# Altium schematic sheet cpu1_gsm_comm.SchDoc
size A3; DocumentNumber: 4; Revision: V1.0; SheetNumber: 4; SheetTotal: 9; Rule: PcbType=ProtelPcb
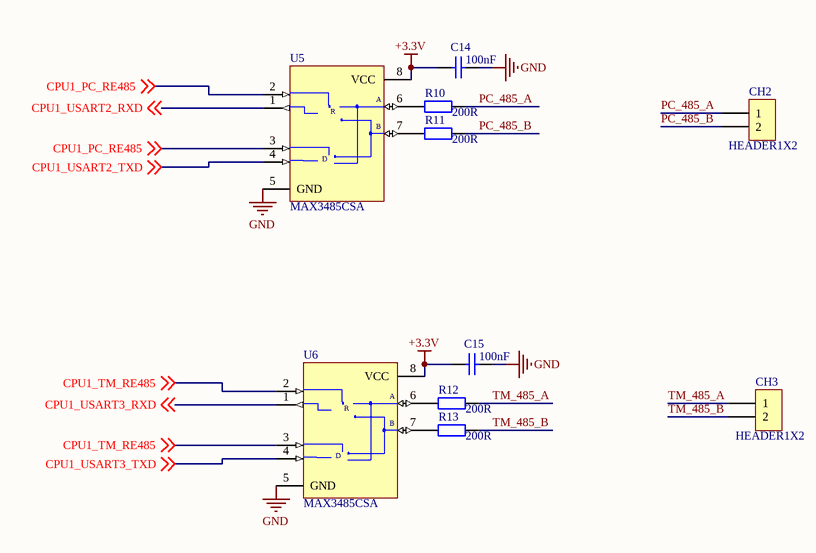
[diagram p0: cpu1_gsm_comm.SchDoc]

## Parts
C14  100nF  [0805_C]
C15  100nF  [0805_C]
CH2  HEADER1X2  [CH3.96-2PIN]
CH3  HEADER1X2  [CH3.96-2PIN]
R10  200R  [0805_R]
R11  200R  [0805_R]
R12  200R  [0805_R]
R13  200R  [0805_R]
U5  MAX3485CSA  [NS08-L]
U6  MAX3485CSA  [NS08-L]

## Nets
+3.3V: C14.2 C15.2 U5.8(VCC) U6.8(VCC)
GND: C14.1 C15.1 U5.5(GND) U6.5(GND)
CPU1_PC_RE485: U5.2(~{RE}) U5.3(DE) ; off-sheet CPU1_PC_RE485
CPU1_TM_RE485: U6.2(~{RE}) U6.3(DE) ; off-sheet CPU1_TM_RE485
CPU1_USART2_RXD: U5.1(RO) ; off-sheet CPU1_USART2_RXD
CPU1_USART2_TXD: U5.4(DI) ; off-sheet CPU1_USART2_TXD
CPU1_USART3_RXD: U6.1(RO) ; off-sheet CPU1_USART3_RXD
CPU1_USART3_TXD: U6.4(DI) ; off-sheet CPU1_USART3_TXD
PC_485_A: CH2.1 R10.2
PC_485_B: CH2.2 R11.2
TM_485_A: CH3.1 R12.2
TM_485_B: CH3.2 R13.2
NetR10_1: R10.1 U5.6(A)
NetR11_1: R11.1 U5.7(B)
NetR12_1: R12.1 U6.6(A)
NetR13_1: R13.1 U6.7(B)

## Notes on the sheet
- :
- (in symbol MAX485CSA) R; D

## Library data of the parts
C14 C15 = 0805 100nF(104) 10% 50V: 贴片电容; ComponentLink1Description: 供应商链接; ComponentLink1URL: http://www.szlcsc.com/product/details_50686.html; Package: 0805; Supplier: LC; SuppliersPartNumber: C49678
R10-R13 = 0805 11KΩ (1102) 1%: 贴片电阻; ComponentLink1Description: 供应商链接; ComponentLink1URL: http://www.szlcsc.com/product/details_18117.html; Package: 0805; Supplier: LC; SuppliersPartNumber: C17429
U5 U6 = MAX485CSA